# Altium schematic sheet MCU.SchDoc
size A3
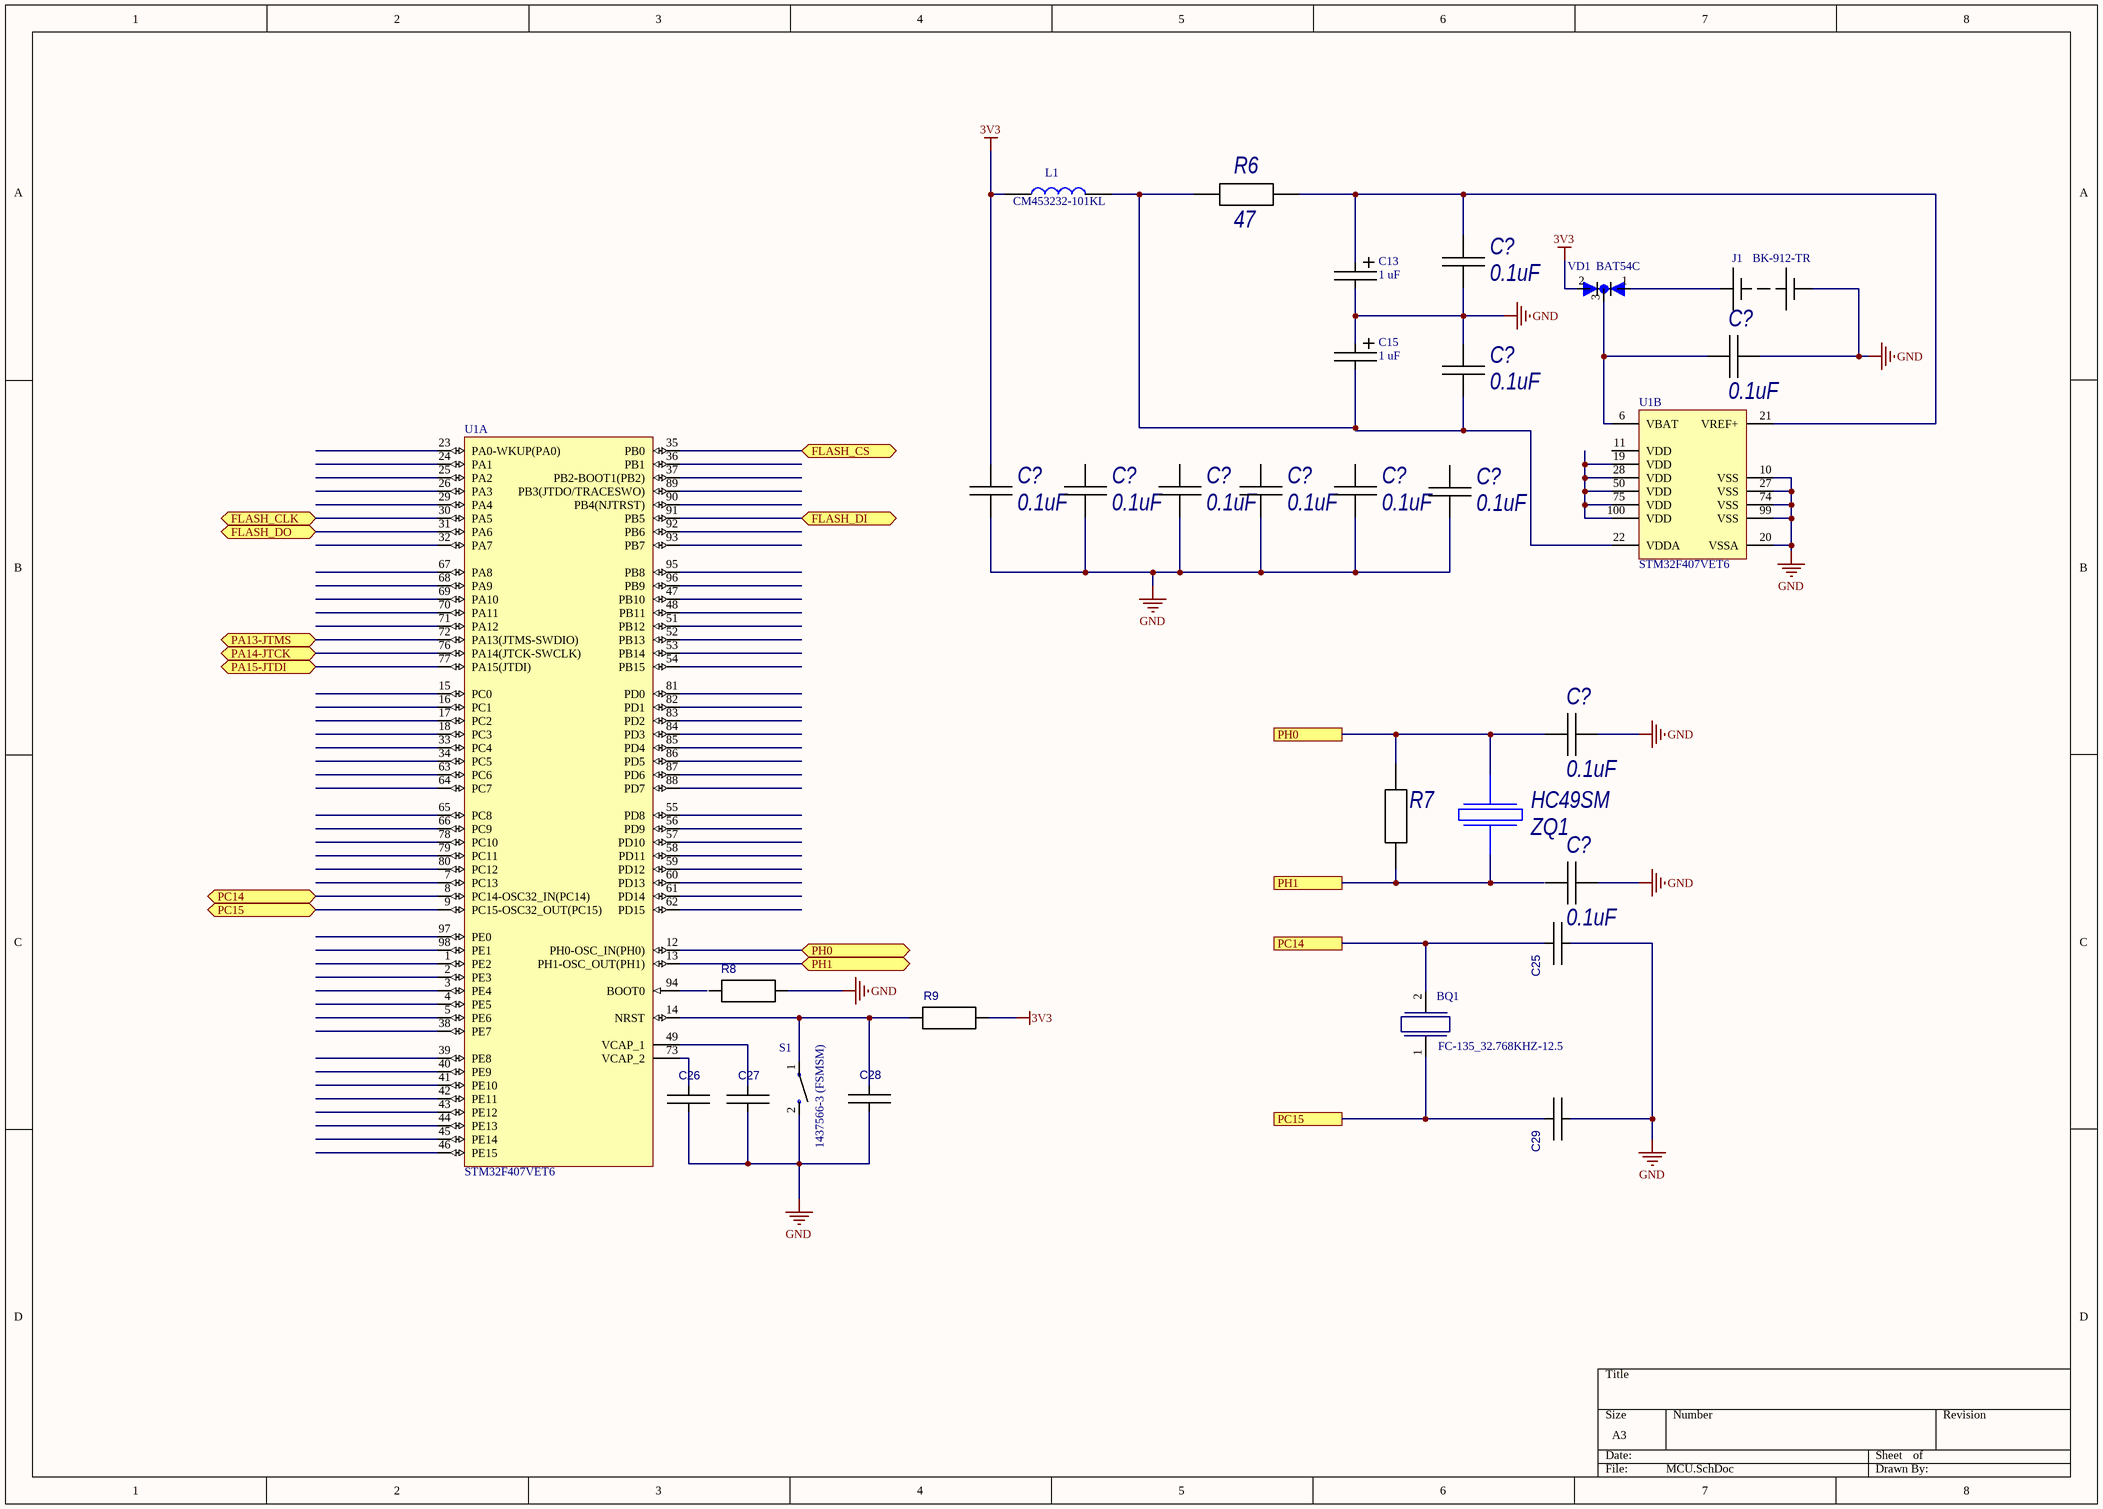
[diagram p0: MCU.SchDoc]

## Parts
(Parts that share a designator on the sheet are numbered #1, #2 ... from top to bottom, then left to right.)
BQ1  FC-135_32.768KHZ-12.5  [FC-135]
C13  1 uF  [TECAP_A]
C15  1 uF  [TECAP_A]
C25  CAP_0805  [C0805C]  (value not drawn)
C26  CAP_0805  [C0805C]  (value not drawn)
C27  CAP_0805  [C0805C]  (value not drawn)
C28  CAP_0805  [C0805C]  (value not drawn)
C29  CAP_0805  [C0805C]  (value not drawn)
C?#1  0.1uF  [C0805C]
C?#2  0.1uF  [C0805C]
C?#3  0.1uF  [C0805C]
C?#4  0.1uF  [C0805C]
C?#5  0.1uF  [C0805C]
C?#6  0.1uF  [C0805C]
C?#7  0.1uF  [C0805C]
C?#8  0.1uF  [C0805C]
C?#9  0.1uF  [C0805C]
C?#10  0.1uF  [C0805C]
C?#11  0.1uF  [C0805C]
J1  BK-912-TR  [BK-912-TR]
L1  CM453232-101KL  [CM453232-101KL]
R6  47  [C0805R]
R7  R0805  [C0805R]  (value not drawn)
R8  RES_0805  [C0805R]  (value not drawn)
R9  RES_0805  [C0805R]  (value not drawn)
S1  1437566-3 (FSMSM)  [1437566-3]  (value not drawn)
U1  STM32F407VET6  [STM-LQFP100_V]  (parts A,B of 2)
VD1  BAT54C  [BAT54C_SOT23-3]
ZQ1  HC49SM  [HC49SM]

## Ports
FLASH_CLK (bidir), FLASH_CS (bidir), FLASH_DI (bidir), FLASH_DO (bidir), PA13-JTMS (bidir), PA14-JTCK (bidir), PA15-JTDI (bidir), PC14, PC14 (bidir), PC15, PC15 (bidir), PH0, PH0 (bidir), PH1, PH1 (bidir)

## Nets
3V3: C?#4.2 L1.1 R9.1 VD1.2(A2)
GND: C13.2 C15.1 C25.2 C26.2 C27.2 C28.2 C29.2 C?#1.1 C?#2.1 C?#3.2 C?#5.1 C?#6.1 C?#7.1 C?#8.1 C?#9.1 C?#10.1 C?#11.1 J1.2(-) R8.1 S1.2 U1.10(VSS) U1.20(VSSA) U1.27(VSS) U1.74(VSS) U1.99(VSS)
FLASH_CLK: U1.30(PA5) ; port FLASH_CLK
FLASH_CS: U1.35(PB0) ; port FLASH_CS
FLASH_DI: U1.91(PB5) ; port FLASH_DI
FLASH_DO: U1.31(PA6) ; port FLASH_DO
PA13-JTMS: U1.72(PA13(JTMS-SWDIO)) ; port PA13-JTMS
PA14-JTCK: U1.76(PA14(JTCK-SWCLK)) ; port PA14-JTCK
PA15-JTDI: U1.77(PA15(JTDI)) ; port PA15-JTDI
PC14: BQ1.2 C25.1 U1.8(PC14-OSC32_IN(PC14)) ; port PC14
PC15: BQ1.1 C29.1 U1.9(PC15-OSC32_OUT(PC15)) ; port PC15
PH0: C?#10.2 R7.2 U1.12(PH0-OSC_IN(PH0)) ZQ1.3 ; port PH0
PH1: R7.1 U1.13(PH1-OSC_OUT(PH1)) ZQ1.1 ; port PH1
NetC13_1: C13.1 C?#1.2 R6.2 U1.21(VREF+)
NetC15_2: C15.2 C?#3.1 L1.2 R6.1 U1.22(VDDA)
NetC26_1: C26.1 U1.73(VCAP_2)
NetC27_1: C27.1 U1.49(VCAP_1)
NetC28_1: C28.1 R9.2 S1.1 U1.14(NRST)
NetC?#2_2: C?#2.2 U1.6(VBAT) VD1.3(C)
NetJ1_1: J1.1(+) VD1.1(A1)
NetU1_19: U1.19(VDD) U1.28(VDD) U1.50(VDD) U1.75(VDD) U1.100(VDD)

Not connected (* = marked no-connect by the designer): C?#4 1; C?#5 2; C?#6 2; C?#7 2; C?#8 2; C?#9 2; C?#11 2; R8 2; U1 1(PE2) 2(PE3) 3(PE4) 4(PE5) 5(PE6) 7(PC13) 11(VDD) 15(PC0) 16(PC1) 17(PC2) 18(PC3) 23(PA0-WKUP(PA0)) 24(PA1) 25(PA2) 26(PA3) 29(PA4) 32(PA7) 33(PC4) 34(PC5) 36(PB1) 37(PB2-BOOT1(PB2)) 38(PE7) 39(PE8) 40(PE9) 41(PE10) 42(PE11) 43(PE12) 44(PE13) 45(PE14) 46(PE15) 47(PB10) 48(PB11) 51(PB12) 52(PB13) 53(PB14) 54(PB15) 55(PD8) 56(PD9) 57(PD10) 58(PD11) 59(PD12) 60(PD13) 61(PD14) 62(PD15) 63(PC6) 64(PC7) 65(PC8) 66(PC9) 67(PA8) 68(PA9) 69(PA10) 70(PA11) 71(PA12) 78(PC10) 79(PC11) 80(PC12) 81(PD0) 82(PD1) 83(PD2) 84(PD3) 85(PD4) 86(PD5) 87(PD6) 88(PD7) 89(PB3(JTDO/TRACESWO)) 90(PB4(NJTRST)) 92(PB6) 93(PB7) 94(BOOT0) 95(PB8) 96(PB9) 97(PE0) 98(PE1)

## Notes on the sheet
- (near S1) 1437566-3 (FSMSM)

## Library data of the parts
BQ1 = FC135-32768-7: Clock SMD Crystal
C13 C15 = TECAP_A: Tantalum pol cap type A
C?#1-C?#11 = CAP_0805: Type: Конденсатор; Published: 18.05.2010; Publisher: Andrew Danich
J1 = BK-912-TR: Holder Coin Cell 20mm Smd
L1 = CM453232-471KL: BOURNS - CM453232-101KL - INDUCTOR, 4532 CASE, 100UH; Allied_Number: 70154277; Geometry.Height: 3.4mm; Manufacturer_Name: Bourns; Manufacturer_Part_Number: CM453232-471KL; RS Part Number: 6934353; RS Price/Stock: http://uk.rs-online.com/web/p/products/6934353; Allied Price/Stock: https://www.alliedelec.com/bourns-cm453232-471kl/70154277/; Arrow Part Number: CM453232-471KL; Arrow Price/Stock: https://www.arrow.com/en/products/cm453232-471kl/bourns; Datasheet Link: https://www.bourns.com/pdfs/cm.pdf
R6 = R0805: Published: 24.03.2010; Publisher: Andrew Danich; Type: Резистор
S1 = 1437566-3: FSMSM=3.5X6 SMT TACT; Configuration_Pole-Throw: Single Pole - Single Throw; Contact_Current_Rating: 50 mA; MF: TE Connectivity; MP: 1437566-3; SnapEDA_Link: https://www.snapeda.com/parts/1437566-3/TE%20Connectivity/view-part/?ref=snap; Package: None; Availability: Unavailable; Price: None; Value: *
U1 = STM32F407VET6: ARM Cortex-M4 32-bit MCU+FPU, 210 DMIPS, 512 kB Flash, 192 kB Internal RAM, 82 I/Os, 100-pin LQFP, -40 to 85 degC, Tray; Manufacturer: STMicroelectronics; D/A Converter: 2x12-bit; FLASH Size (Prog) (kB): 512; I/Os (High Current): 82; Internal RAM Size (kB): 192; Operating Frequency(F) (Processor speed) (MHz): 168; Supply Voltage(Vcc) max (V): 3.6; Supply Voltage(Vcc) min (V): 1.8; DatasheetVersion: Rev. 4; PackageVersion: Rev. 1, 06/2013; PackageReference: LQFP100; PackageDescription: 100-Pin Low Profile Quad Flat Package, 14 x 14 mm Body, 0.5 mm Pitch; Supplier 1: Digi-Key; Supplier Part Number 1: 497-12075-ND; Supplier 2: Farnell; Supplier Part Number 2: 2064367; Supplier 3: Newark; Supplier Part Number 3: 73T2332; Supplier 4: Mouser; Supplier Part Number 4: 511-STM32F407VET6; Core: ARM Cortex-M4; Packing: Tray; Mounting Technology: Surface Mount; PartNumber: STM32F407VET6; ComponentLink1Description: Manufacturer URL; ComponentLink1URL: http://www.st.com/web/en/home.html; ComponentLink2Description: Datasheet; ComponentLink2URL: http://www.st.com/st-web-ui/static/active/en/resource/technical/document/datasheet/DM00037051.pdf; ComponentLink3Description: Package Specification; ComponentLink3URL: http://www.st.com/st-web-ui/static/active/en/resource/technical/document/data_brief/DM00071938.pdf
VD1 = BAT54C: Small Signal Schottky Diode, Dual Common Cathode, 30 V, 200 mA, 400 mV, 600 mA, 125 C
C25-C29 = CAP_0805: Value: *
R7 = R0805: Published: 24.03.2010; Publisher: Andrew Danich; Type: Резистор
R8 R9 = RES_0805: Value: *
ZQ1 = HC49SM: Published: 08.03.2013; Publisher: Andrew Danich; Type: Резонатор